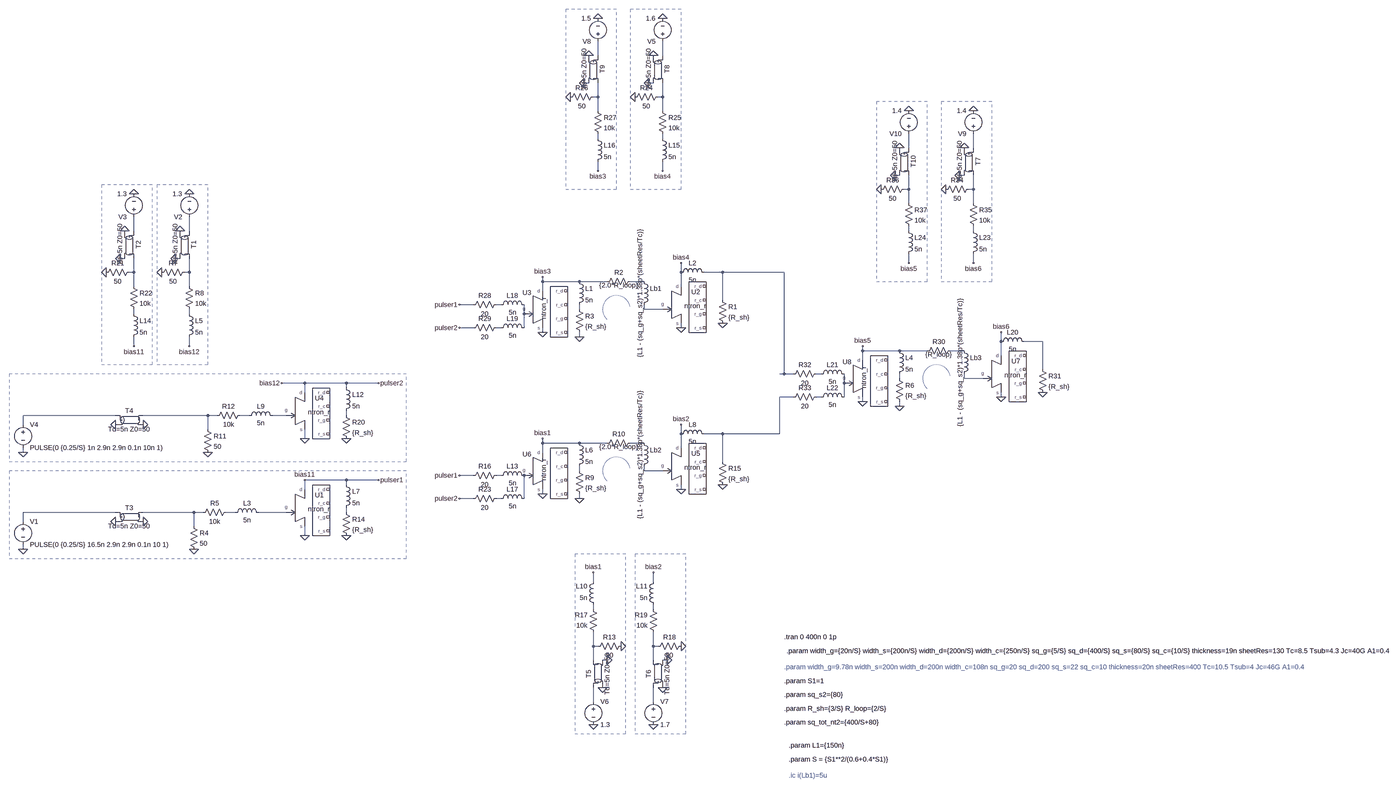
[diagram p0: schematic SNN_2input.asc, whole sheet]
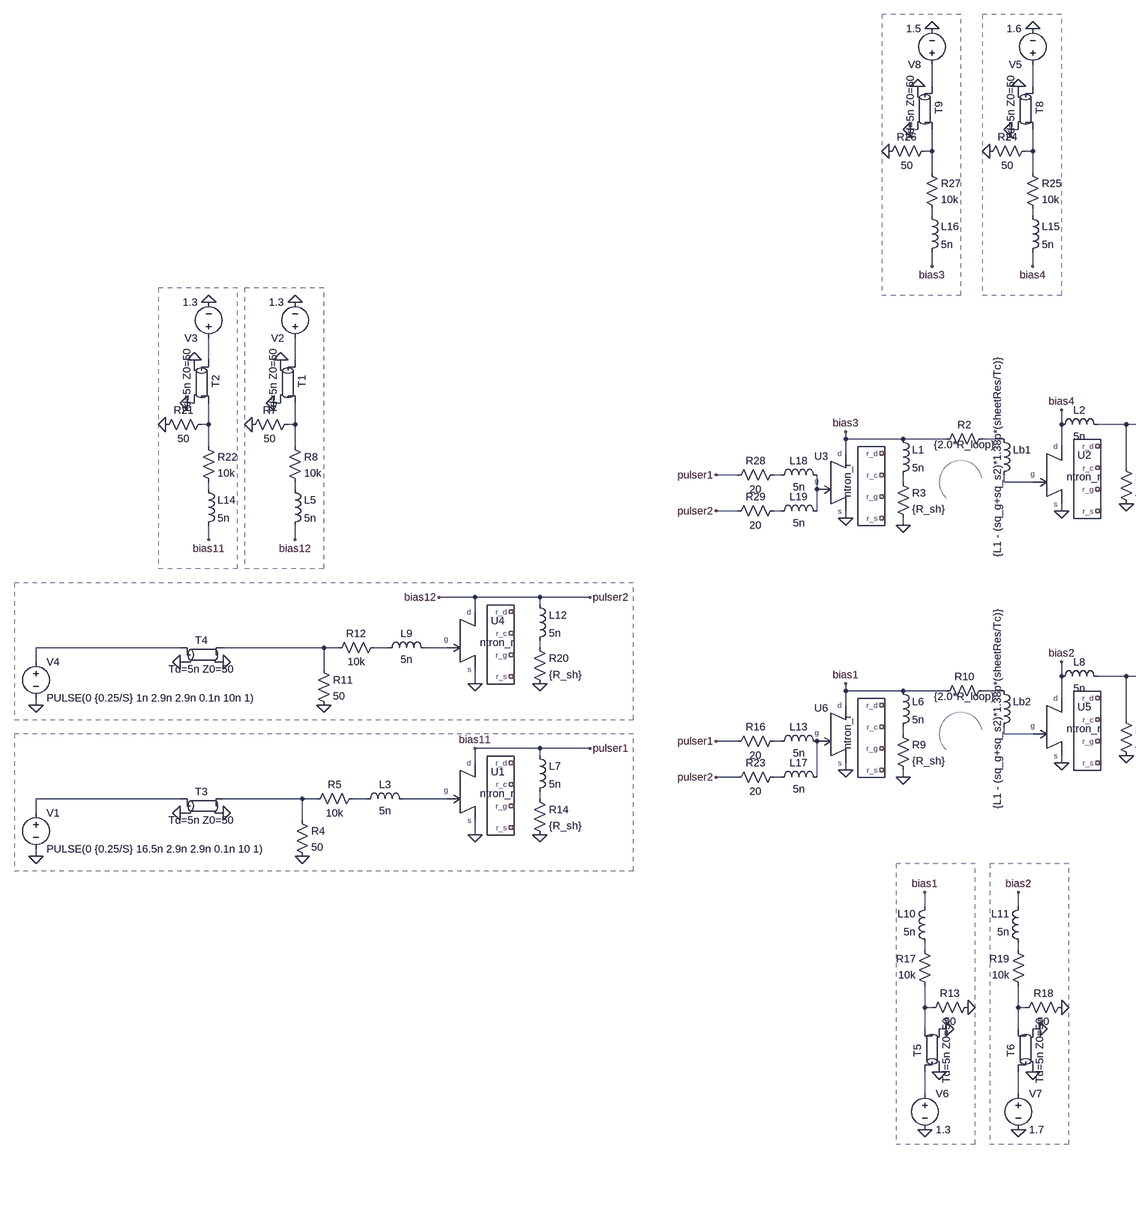
[diagram p1: schematic SNN_2input.asc, part, row 1 of 1, column 1 of 2]
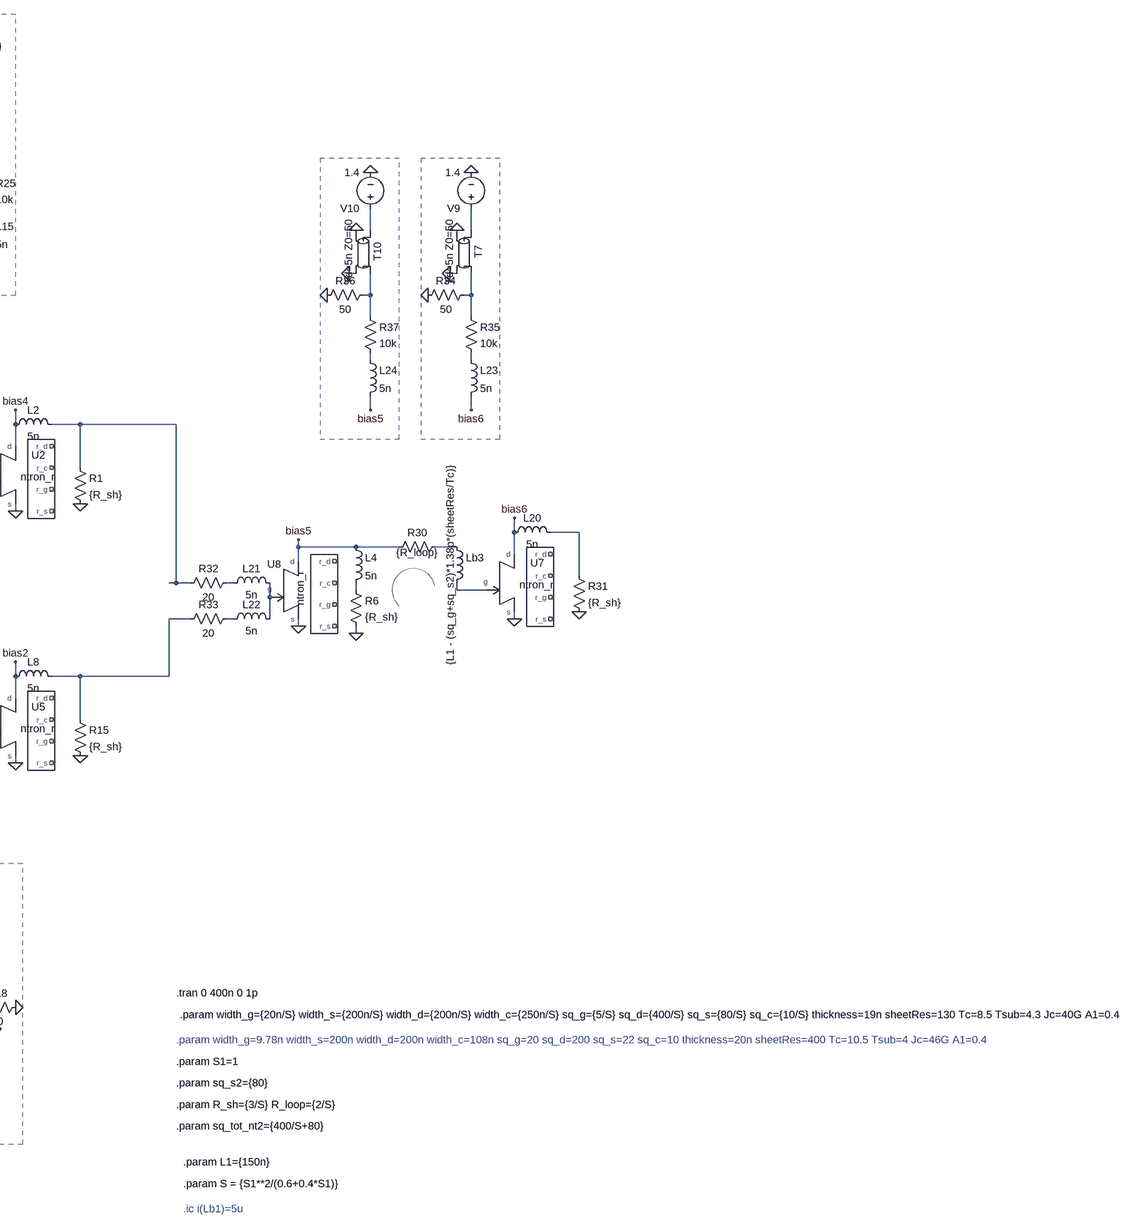
[diagram p2: schematic SNN_2input.asc, part, row 1 of 1, column 2 of 2]
SNN_2input.asc, the LTspice schematic file:
Version 4
SHEET 1 3684 2036
WIRE -992 -1296 -992 -1344
WIRE -768 -1296 -768 -1344
WIRE -1024 -1200 -1040 -1200
WIRE -800 -1200 -816 -1200
WIRE -992 -1152 -992 -1200
WIRE -992 -1152 -1008 -1152
WIRE -768 -1152 -768 -1200
WIRE -768 -1152 -784 -1152
WIRE -992 -1104 -992 -1152
WIRE -768 -1104 -768 -1152
WIRE -992 -1008 -992 -1024
WIRE -768 -1008 -768 -1024
WIRE 240 -976 240 -1024
WIRE 464 -976 464 -1024
WIRE -992 -896 -992 -928
WIRE -768 -896 -768 -928
WIRE 208 -880 192 -880
WIRE 432 -880 416 -880
WIRE 240 -832 240 -880
WIRE 240 -832 224 -832
WIRE 464 -832 464 -880
WIRE 464 -832 448 -832
WIRE 240 -784 240 -832
WIRE 464 -784 464 -832
WIRE -2800 -688 -2800 -736
WIRE -2608 -688 -2608 -736
WIRE 240 -688 240 -704
WIRE 464 -688 464 -704
WIRE -2832 -592 -2848 -592
WIRE -2640 -592 -2656 -592
WIRE 240 -576 240 -608
WIRE 464 -576 464 -608
WIRE -2800 -544 -2800 -592
WIRE -2800 -544 -2816 -544
WIRE -2608 -544 -2608 -592
WIRE -2608 -544 -2624 -544
WIRE -704 -544 -704 -576
WIRE -560 -544 -624 -544
WIRE -192 -544 -560 -544
WIRE -1184 -512 -1184 -528
WIRE -1056 -512 -1184 -512
WIRE -960 -512 -1056 -512
WIRE -832 -512 -880 -512
WIRE -2800 -496 -2800 -544
WIRE -2608 -496 -2608 -544
WIRE -704 -496 -704 -544
WIRE -1184 -480 -1184 -512
WIRE -560 -448 -560 -544
WIRE -1424 -432 -1472 -432
WIRE -1328 -432 -1344 -432
WIRE -1056 -416 -1056 -432
WIRE -832 -416 -832 -432
WIRE -768 -416 -832 -416
WIRE -2800 -400 -2800 -416
WIRE -2608 -400 -2608 -416
WIRE -1248 -400 -1248 -432
WIRE -1424 -352 -1472 -352
WIRE -1328 -352 -1344 -352
WIRE -1248 -352 -1248 -400
WIRE -704 -352 -704 -368
WIRE -1184 -336 -1184 -352
WIRE -1056 -320 -1056 -336
WIRE 560 -304 560 -336
WIRE 704 -304 640 -304
WIRE -2800 -288 -2800 -320
WIRE -2608 -288 -2608 -320
WIRE 80 -272 80 -288
WIRE 208 -272 80 -272
WIRE 304 -272 208 -272
WIRE 432 -272 384 -272
WIRE 560 -256 560 -304
WIRE 80 -240 80 -272
WIRE 704 -208 704 -304
WIRE -192 -192 -192 -544
WIRE -192 -192 -208 -192
WIRE -160 -192 -192 -192
WIRE -64 -192 -80 -192
WIRE 208 -176 208 -192
WIRE 432 -176 432 -192
WIRE 496 -176 432 -176
WIRE -2208 -160 -2288 -160
WIRE -2064 -160 -2208 -160
WIRE -1952 -160 -2064 -160
WIRE 16 -160 16 -192
WIRE -2064 -144 -2064 -160
WIRE -2208 -128 -2208 -160
WIRE -160 -112 -208 -112
WIRE -64 -112 -80 -112
WIRE 16 -112 16 -160
WIRE 560 -112 560 -128
WIRE 80 -96 80 -112
WIRE 208 -80 208 -96
WIRE -2864 -48 -3184 -48
WIRE -2544 -48 -2768 -48
WIRE -2512 -48 -2544 -48
WIRE -2400 -48 -2432 -48
WIRE -2272 -48 -2320 -48
WIRE -2064 -48 -2064 -64
WIRE -3184 -16 -3184 -48
WIRE -2544 0 -2544 -48
WIRE -704 16 -704 -16
WIRE -560 16 -624 16
WIRE -208 16 -208 -112
WIRE -208 16 -560 16
WIRE -2208 32 -2208 0
WIRE -1184 48 -1184 32
WIRE -1056 48 -1184 48
WIRE -960 48 -1056 48
WIRE -832 48 -880 48
WIRE -704 64 -704 16
WIRE -3184 80 -3184 64
WIRE -1184 80 -1184 48
WIRE -560 112 -560 16
WIRE -1056 144 -1056 128
WIRE -832 144 -832 128
WIRE -768 144 -832 144
WIRE -1424 160 -1472 160
WIRE -1328 160 -1344 160
WIRE -2064 176 -2208 176
WIRE -1952 176 -2064 176
WIRE -2064 192 -2064 176
WIRE -2208 208 -2208 176
WIRE -704 208 -704 192
WIRE -1184 224 -1184 208
WIRE -1424 240 -1472 240
WIRE -1328 240 -1344 240
WIRE -1248 240 -1248 160
WIRE -1056 240 -1056 224
WIRE -2864 288 -3184 288
WIRE -2592 288 -2768 288
WIRE -2560 288 -2592 288
WIRE -2448 288 -2480 288
WIRE -2272 288 -2368 288
WIRE -2064 288 -2064 272
WIRE -3184 320 -3184 288
WIRE -2592 336 -2592 288
WIRE -2208 368 -2208 336
WIRE -3184 416 -3184 400
WIRE -1008 528 -1008 496
WIRE -800 528 -800 496
WIRE -1008 624 -1008 608
WIRE -800 624 -800 608
WIRE -1008 752 -1008 704
WIRE -992 752 -1008 752
WIRE -800 752 -800 704
WIRE -784 752 -800 752
WIRE -1008 800 -1008 752
WIRE -960 800 -976 800
WIRE -800 800 -800 752
WIRE -752 800 -768 800
WIRE -1008 944 -1008 896
WIRE -800 944 -800 896
FLAG -704 -352 0
FLAG -1056 -320 0
FLAG -2592 416 0
FLAG -3184 416 0
FLAG -2768 320 0
FLAG -2864 320 0
FLAG -2208 368 0
FLAG -2064 368 0
FLAG -2544 80 0
FLAG -3184 80 0
FLAG -2768 -16 0
FLAG -2864 -16 0
FLAG -1184 -336 0
FLAG -912 752 0
FLAG -976 896 0
FLAG -960 800 0
FLAG -1008 1024 0
FLAG -1008 496 bias1
FLAG -704 752 0
FLAG -768 896 0
FLAG -752 800 0
FLAG -800 1024 0
FLAG -800 496 bias2
FLAG -2208 32 0
FLAG -2064 32 0
FLAG -1952 176 pulser1
FLAG -1952 -160 pulser2
FLAG -2288 -160 bias12
FLAG -864 -1152 0
FLAG -800 -1296 0
FLAG -816 -1200 0
FLAG -768 -1424 0
FLAG -768 -896 bias4
FLAG -1088 -1152 0
FLAG -1024 -1296 0
FLAG -1040 -1200 0
FLAG -992 -1424 0
FLAG -992 -896 bias3
FLAG -1184 -528 bias3
FLAG -704 -576 bias4
FLAG -560 -368 0
FLAG -2704 -544 0
FLAG -2640 -688 0
FLAG -2656 -592 0
FLAG -2608 -816 0
FLAG -2608 -288 bias12
FLAG -704 208 0
FLAG -1056 240 0
FLAG -1184 224 0
FLAG -1184 32 bias1
FLAG -704 -16 bias2
FLAG -560 192 0
FLAG -2896 -544 0
FLAG -2832 -688 0
FLAG -2848 -592 0
FLAG -2800 -816 0
FLAG -2800 -288 bias11
FLAG -2208 176 bias11
FLAG -1472 160 pulser1
FLAG -1472 240 pulser2
FLAG -1472 -432 pulser1
FLAG -1472 -352 pulser2
FLAG 560 -112 0
FLAG 208 -80 0
FLAG 80 -96 0
FLAG 80 -288 bias5
FLAG 560 -336 bias6
FLAG 704 -128 0
FLAG 368 -832 0
FLAG 432 -976 0
FLAG 416 -880 0
FLAG 464 -1104 0
FLAG 464 -576 bias6
FLAG 144 -832 0
FLAG 208 -976 0
FLAG 192 -880 0
FLAG 240 -1104 0
FLAG 240 -576 bias5
SYMBOL ind -848 -528 R0
WINDOW 3 2 -165 VRight 2
SYMATTR Value {L1 - (sq_g+sq_s2)*1.38p*(sheetRes/Tc)}
SYMATTR InstName Lb1
SYMBOL ntron_r -704 -432 R0
WINDOW 39 2 131 Invisible 2
WINDOW 3 50 -11 Top 2
WINDOW 0 51 -28 Bottom 2
SYMATTR SpiceLine width_g={width_g} width_s={width_s} width_d={width_d} width_c={width_c} sq_g={sq_g} sq_d={sq_tot_nt2-sq_s2} sq_s={sq_s2} sq_c={sq_c} thickness={thickness} sheetRes={sheetRes} Tc={Tc} Tsub={Tsub} Jc={Jc} A1={A1}
SYMATTR InstName U2
SYMBOL res -1072 -432 R0
SYMATTR InstName R3
SYMATTR Value {R_sh}
SYMBOL ind -1072 -528 R0
SYMATTR InstName L1
SYMATTR Value 5n
SYMBOL res -2608 320 R0
SYMATTR InstName R4
SYMATTR Value 50
SYMBOL res -2576 304 R270
WINDOW 0 32 56 VTop 2
WINDOW 3 0 56 VBottom 2
SYMATTR InstName R5
SYMATTR Value 10k
SYMBOL ind -2464 304 R270
WINDOW 0 32 56 VTop 2
WINDOW 3 5 56 VBottom 2
SYMATTR InstName L3
SYMATTR Value 5n
SYMBOL voltage -3184 304 R0
WINDOW 123 0 0 Left 2
WINDOW 39 0 0 Left 2
SYMATTR InstName V1
SYMATTR Value PULSE(0 {0.25/S} 16.5n 2.9n 2.9n 0.1n 10 1)
SYMBOL tline -2816 304 R0
SYMATTR InstName T3
SYMATTR Value Td=5n Z0=50
SYMBOL res -976 -496 R270
WINDOW 0 32 56 VTop 2
WINDOW 3 19 56 VBottom 2
SYMATTR InstName R2
SYMATTR Value {2.0*R_loop}
SYMBOL ntron_r -1184 -416 R0
WINDOW 39 2 131 Invisible 2
WINDOW 3 20 -4 VBottom 2
WINDOW 0 -54 -42 Bottom 2
SYMATTR SpiceLine width_g={width_g} width_s={width_s} width_d={width_d} width_c={width_c} sq_g=10 sq_d={sq_d} sq_s={sq_s} sq_c={sq_c} thickness={thickness} sheetRes={sheetRes} Tc={Tc} Tsub={Tsub} Jc={Jc} A1={A1}
SYMATTR InstName U3
SYMBOL res -2080 272 R0
SYMATTR InstName R14
SYMATTR Value {R_sh}
SYMBOL ind -2080 176 R0
SYMATTR InstName L7
SYMATTR Value 5n
SYMBOL ntron_r -2208 272 R0
WINDOW 39 2 131 Invisible 2
WINDOW 3 50 -11 Top 2
WINDOW 0 51 -28 Bottom 2
SYMATTR SpiceLine width_g={width_g} width_s={width_s} width_d={width_d} width_c={width_c} sq_g=10 sq_d={sq_d} sq_s={sq_s} sq_c={sq_c} thickness={thickness} sheetRes={sheetRes} Tc={Tc} Tsub={Tsub} Jc={Jc} A1={A1}
SYMATTR InstName U1
SYMBOL res -2560 -16 R0
SYMATTR InstName R11
SYMATTR Value 50
SYMBOL res -2528 -32 R270
WINDOW 0 32 56 VTop 2
WINDOW 3 0 56 VBottom 2
SYMATTR InstName R12
SYMATTR Value 10k
SYMBOL ind -2416 -32 R270
WINDOW 0 32 56 VTop 2
WINDOW 3 5 56 VBottom 2
SYMATTR InstName L9
SYMATTR Value 5n
SYMBOL voltage -3184 -32 R0
WINDOW 123 0 0 Left 2
WINDOW 39 0 0 Left 2
SYMATTR InstName V4
SYMATTR Value PULSE(0 {0.25/S} 1n 2.9n 2.9n 0.1n 10n 1)
SYMBOL tline -2816 -32 R0
SYMATTR InstName T4
SYMATTR Value Td=5n Z0=50
SYMBOL tline -992 848 R270
SYMATTR InstName T5
SYMATTR Value Td=5n Z0=50
SYMBOL res -1008 768 R270
WINDOW 0 32 56 VTop 2
WINDOW 3 0 56 VBottom 2
SYMATTR InstName R13
SYMATTR Value 50
SYMBOL res -992 720 R180
WINDOW 0 36 76 Left 2
WINDOW 3 36 40 Left 2
SYMATTR InstName R17
SYMATTR Value 10k
SYMBOL ind -992 624 R180
WINDOW 0 36 80 Left 2
WINDOW 3 36 40 Left 2
SYMATTR InstName L10
SYMATTR Value 5n
SYMBOL voltage -1008 928 R0
WINDOW 123 0 0 Left 2
WINDOW 39 0 0 Left 2
SYMATTR InstName V6
SYMATTR Value 1.3
SYMBOL tline -784 848 R270
SYMATTR InstName T6
SYMATTR Value Td=5n Z0=50
SYMBOL res -800 768 R270
WINDOW 0 32 56 VTop 2
WINDOW 3 0 56 VBottom 2
SYMATTR InstName R18
SYMATTR Value 50
SYMBOL res -784 720 R180
WINDOW 0 36 76 Left 2
WINDOW 3 36 40 Left 2
SYMATTR InstName R19
SYMATTR Value 10k
SYMBOL ind -784 624 R180
WINDOW 0 36 80 Left 2
WINDOW 3 36 40 Left 2
SYMATTR InstName L11
SYMATTR Value 5n
SYMBOL voltage -800 928 R0
WINDOW 123 0 0 Left 2
WINDOW 39 0 0 Left 2
SYMATTR InstName V7
SYMATTR Value 1.7
SYMBOL res -2080 -64 R0
SYMATTR InstName R20
SYMATTR Value {R_sh}
SYMBOL ind -2080 -160 R0
SYMATTR InstName L12
SYMATTR Value 5n
SYMBOL ntron_r -2208 -64 R0
WINDOW 39 2 131 Invisible 2
WINDOW 3 50 -11 Top 2
WINDOW 0 51 -28 Bottom 2
SYMATTR SpiceLine width_g={width_g} width_s={width_s} width_d={width_d} width_c={width_c} sq_g=10 sq_d={sq_d} sq_s={sq_s} sq_c={sq_c} thickness={thickness} sheetRes={sheetRes} Tc={Tc} Tsub={Tsub} Jc={Jc} A1={A1}
SYMATTR InstName U4
SYMBOL tline -784 -1248 R90
SYMATTR InstName T8
SYMATTR Value Td=5n Z0=50
SYMBOL res -768 -1168 R90
WINDOW 0 0 56 VBottom 2
WINDOW 3 32 56 VTop 2
SYMATTR InstName R24
SYMATTR Value 50
SYMBOL res -784 -1120 R0
SYMATTR InstName R25
SYMATTR Value 10k
SYMBOL ind -784 -1024 R0
SYMATTR InstName L15
SYMATTR Value 5n
SYMBOL voltage -768 -1328 R180
WINDOW 123 0 0 Left 2
WINDOW 39 0 0 Left 2
SYMATTR InstName V5
SYMATTR Value 1.6
SYMBOL tline -1008 -1248 R90
SYMATTR InstName T9
SYMATTR Value Td=5n Z0=50
SYMBOL res -992 -1168 R90
WINDOW 0 0 56 VBottom 2
WINDOW 3 32 56 VTop 2
SYMATTR InstName R26
SYMATTR Value 50
SYMBOL res -1008 -1120 R0
SYMATTR InstName R27
SYMATTR Value 10k
SYMBOL ind -1008 -1024 R0
SYMATTR InstName L16
SYMATTR Value 5n
SYMBOL voltage -992 -1328 R180
WINDOW 123 0 0 Left 2
WINDOW 39 0 0 Left 2
SYMATTR InstName V8
SYMATTR Value 1.5
SYMBOL ind -720 -528 R270
WINDOW 0 32 56 VTop 2
WINDOW 3 5 56 VBottom 2
SYMATTR InstName L2
SYMATTR Value 5n
SYMBOL res -576 -464 R0
SYMATTR InstName R1
SYMATTR Value {R_sh}
SYMBOL tline -2624 -640 R90
SYMATTR InstName T1
SYMATTR Value Td=5n Z0=50
SYMBOL res -2608 -560 R90
WINDOW 0 0 56 VBottom 2
WINDOW 3 32 56 VTop 2
SYMATTR InstName R7
SYMATTR Value 50
SYMBOL res -2624 -512 R0
SYMATTR InstName R8
SYMATTR Value 10k
SYMBOL ind -2624 -416 R0
SYMATTR InstName L5
SYMATTR Value 5n
SYMBOL voltage -2608 -720 R180
WINDOW 123 0 0 Left 2
WINDOW 39 0 0 Left 2
SYMATTR InstName V2
SYMATTR Value 1.3
SYMBOL ind -848 32 R0
WINDOW 3 2 -165 VRight 2
SYMATTR Value {L1 - (sq_g+sq_s2)*1.38p*(sheetRes/Tc)}
SYMATTR InstName Lb2
SYMBOL ntron_r -704 128 R0
WINDOW 39 2 131 Invisible 2
WINDOW 3 50 -11 Top 2
WINDOW 0 51 -28 Bottom 2
SYMATTR SpiceLine width_g={width_g} width_s={width_s} width_d={width_d} width_c={width_c} sq_g={sq_g} sq_d={sq_tot_nt2-sq_s2} sq_s={sq_s2} sq_c={sq_c} thickness={thickness} sheetRes={sheetRes} Tc={Tc} Tsub={Tsub} Jc={Jc} A1={A1}
SYMATTR InstName U5
SYMBOL res -1072 128 R0
SYMATTR InstName R9
SYMATTR Value {R_sh}
SYMBOL ind -1072 32 R0
SYMATTR InstName L6
SYMATTR Value 5n
SYMBOL res -976 64 R270
WINDOW 0 32 56 VTop 2
WINDOW 3 19 56 VBottom 2
SYMATTR InstName R10
SYMATTR Value {2.0*R_loop}
SYMBOL ntron_r -1184 144 R0
WINDOW 39 2 131 Invisible 2
WINDOW 3 20 -4 VBottom 2
WINDOW 0 -54 -42 Bottom 2
SYMATTR SpiceLine width_g={width_g} width_s={width_s} width_d={width_d} width_c={width_c} sq_g=10 sq_d={sq_d} sq_s={sq_s} sq_c={sq_c} thickness={thickness} sheetRes={sheetRes} Tc={Tc} Tsub={Tsub} Jc={Jc} A1={A1}
SYMATTR InstName U6
SYMBOL ind -720 32 R270
WINDOW 0 32 56 VTop 2
WINDOW 3 5 56 VBottom 2
SYMATTR InstName L8
SYMATTR Value 5n
SYMBOL res -576 96 R0
SYMATTR InstName R15
SYMATTR Value {R_sh}
SYMBOL ind -1344 176 R270
WINDOW 0 32 56 VTop 2
WINDOW 3 5 56 VBottom 2
SYMATTR InstName L13
SYMATTR Value 5n
SYMBOL res -1328 144 R90
WINDOW 0 0 56 VBottom 2
WINDOW 3 32 56 VTop 2
SYMATTR InstName R16
SYMATTR Value 20
SYMBOL tline -2816 -640 R90
SYMATTR InstName T2
SYMATTR Value Td=5n Z0=50
SYMBOL res -2800 -560 R90
WINDOW 0 0 56 VBottom 2
WINDOW 3 32 56 VTop 2
SYMATTR InstName R21
SYMATTR Value 50
SYMBOL res -2816 -512 R0
SYMATTR InstName R22
SYMATTR Value 10k
SYMBOL ind -2816 -416 R0
SYMATTR InstName L14
SYMATTR Value 5n
SYMBOL voltage -2800 -720 R180
WINDOW 123 0 0 Left 2
WINDOW 39 0 0 Left 2
SYMATTR InstName V3
SYMATTR Value 1.3
SYMBOL ind -1344 256 R270
WINDOW 0 32 56 VTop 2
WINDOW 3 5 56 VBottom 2
SYMATTR InstName L17
SYMATTR Value 5n
SYMBOL res -1328 224 R90
WINDOW 0 0 56 VBottom 2
WINDOW 3 32 56 VTop 2
SYMATTR InstName R23
SYMATTR Value 20
SYMBOL ind -1344 -416 R270
WINDOW 0 32 56 VTop 2
WINDOW 3 5 56 VBottom 2
SYMATTR InstName L18
SYMATTR Value 5n
SYMBOL res -1328 -448 R90
WINDOW 0 0 56 VBottom 2
WINDOW 3 32 56 VTop 2
SYMATTR InstName R28
SYMATTR Value 20
SYMBOL ind -1344 -336 R270
WINDOW 0 32 56 VTop 2
WINDOW 3 5 56 VBottom 2
SYMATTR InstName L19
SYMATTR Value 5n
SYMBOL res -1328 -368 R90
WINDOW 0 0 56 VBottom 2
WINDOW 3 32 56 VTop 2
SYMATTR InstName R29
SYMATTR Value 20
SYMBOL ind 416 -288 R0
WINDOW 3 2 -165 VRight 2
SYMATTR Value {L1 - (sq_g+sq_s2)*1.38p*(sheetRes/Tc)}
SYMATTR InstName Lb3
SYMBOL ntron_r 560 -192 R0
WINDOW 39 2 131 Invisible 2
WINDOW 3 50 -11 Top 2
WINDOW 0 51 -28 Bottom 2
SYMATTR SpiceLine width_g={width_g} width_s={width_s} width_d={width_d} width_c={width_c} sq_g={sq_g} sq_d={sq_tot_nt2-sq_s2} sq_s={sq_s2} sq_c={sq_c} thickness={thickness} sheetRes={sheetRes} Tc={Tc} Tsub={Tsub} Jc={Jc} A1={A1}
SYMATTR InstName U7
SYMBOL res 192 -192 R0
SYMATTR InstName R6
SYMATTR Value {R_sh}
SYMBOL ind 192 -288 R0
SYMATTR InstName L4
SYMATTR Value 5n
SYMBOL res 288 -256 R270
WINDOW 0 32 56 VTop 2
WINDOW 3 19 56 VBottom 2
SYMATTR InstName R30
SYMATTR Value {R_loop}
SYMBOL ntron_r 80 -176 R0
WINDOW 39 2 131 Invisible 2
WINDOW 3 20 -4 VBottom 2
WINDOW 0 -54 -42 Bottom 2
SYMATTR SpiceLine width_g={width_g} width_s={width_s} width_d={width_d} width_c={width_c} sq_g=10 sq_d={sq_d} sq_s={sq_s} sq_c={sq_c} thickness={thickness} sheetRes={sheetRes} Tc={Tc} Tsub={Tsub} Jc={Jc} A1={A1}
SYMATTR InstName U8
SYMBOL ind 544 -288 R270
WINDOW 0 32 56 VTop 2
WINDOW 3 5 56 VBottom 2
SYMATTR InstName L20
SYMATTR Value 5n
SYMBOL res 688 -224 R0
SYMATTR InstName R31
SYMATTR Value {R_sh}
SYMBOL ind -80 -176 R270
WINDOW 0 32 56 VTop 2
WINDOW 3 5 56 VBottom 2
SYMATTR InstName L21
SYMATTR Value 5n
SYMBOL res -64 -208 R90
WINDOW 0 0 56 VBottom 2
WINDOW 3 32 56 VTop 2
SYMATTR InstName R32
SYMATTR Value 20
SYMBOL ind -80 -96 R270
WINDOW 0 32 56 VTop 2
WINDOW 3 5 56 VBottom 2
SYMATTR InstName L22
SYMATTR Value 5n
SYMBOL res -64 -128 R90
WINDOW 0 0 56 VBottom 2
WINDOW 3 32 56 VTop 2
SYMATTR InstName R33
SYMATTR Value 20
SYMBOL tline 448 -928 R90
SYMATTR InstName T7
SYMATTR Value Td=5n Z0=50
SYMBOL res 464 -848 R90
WINDOW 0 0 56 VBottom 2
WINDOW 3 32 56 VTop 2
SYMATTR InstName R34
SYMATTR Value 50
SYMBOL res 448 -800 R0
SYMATTR InstName R35
SYMATTR Value 10k
SYMBOL ind 448 -704 R0
SYMATTR InstName L23
SYMATTR Value 5n
SYMBOL voltage 464 -1008 R180
WINDOW 123 0 0 Left 2
WINDOW 39 0 0 Left 2
SYMATTR InstName V9
SYMATTR Value 1.4
SYMBOL tline 224 -928 R90
SYMATTR InstName T10
SYMATTR Value Td=5n Z0=50
SYMBOL res 240 -848 R90
WINDOW 0 0 56 VBottom 2
WINDOW 3 32 56 VTop 2
SYMATTR InstName R36
SYMATTR Value 50
SYMBOL res 224 -800 R0
SYMATTR InstName R37
SYMATTR Value 10k
SYMBOL ind 224 -704 R0
SYMATTR InstName L24
SYMATTR Value 5n
SYMBOL voltage 240 -1008 R180
WINDOW 123 0 0 Left 2
WINDOW 39 0 0 Left 2
SYMATTR InstName V10
SYMATTR Value 1.4
TEXT -192 720 Left 2 !.tran 0 400n 0 1p
TEXT -176 1200 Left 2 ;.ic i(Lb1)=5u
TEXT -184 768 Left 2 !.param width_g={20n/S} width_s={200n/S} width_d={200n/S} width_c={250n/S} sq_g={5/S} sq_d={400/S} sq_s={80/S} sq_c={10/S} thickness=19n sheetRes=130 Tc=8.5 Tsub=4.3 Jc=40G A1=0.4
TEXT -192 968 Left 2 !.param R_sh={3/S} R_loop={2/S}
TEXT -192 824 Left 2 ;.param width_g=9.78n width_s=200n width_d=200n width_c=108n sq_g=20 sq_d=200 sq_s=22 sq_c=10 thickness=20n sheetRes=400 Tc=10.5 Tsub=4 Jc=46G A1=0.4
TEXT -192 920 Left 2 !.param sq_s2={80}
TEXT -192 1016 Left 2 !.param sq_tot_nt2={400/S+80}
TEXT -176 1096 Left 2 !.param L1={150n}
TEXT -192 872 Left 2 !.param S1=1
TEXT -176 1144 Left 2 !.param S = {S1**2/(0.6+0.4*S1)}
RECTANGLE Normal -896 432 -1072 1056 2
RECTANGLE Normal -688 432 -864 1056 2
RECTANGLE Normal -3232 112 -1856 -192 2
RECTANGLE Normal -3232 448 -1856 144 2
RECTANGLE Normal -880 -832 -704 -1456 2
RECTANGLE Normal -1104 -832 -928 -1456 2
RECTANGLE Normal -2720 -224 -2544 -848 2
RECTANGLE Normal -2912 -224 -2736 -848 2
RECTANGLE Normal 352 -512 528 -1136 2
RECTANGLE Normal 128 -512 304 -1136 2
ARC Normal -976 -368 -880 -464 -859 -429 -963 -379 2
ARC Normal -976 192 -880 96 -859 131 -963 181 2
ARC Normal 288 -128 384 -224 405 -189 301 -139 2

The netlist it stands for:
* SNN_2input.asc
Lb1 N018 N021 {L1 - (sq_g+sq_s2)*1.38p*(sheetRes/Tc)}
XU2 N021 bias4 0 NC_01 NC_02 NC_03 NC_04 ntron_r ntron_r width_g={width_g} width_s={width_s} width_d={width_d} width_c={width_c} sq_g={sq_g} sq_d={sq_tot_nt2-sq_s2} sq_s={sq_s2} sq_c={sq_c} thickness={thickness} sheetRes={sheetRes} Tc={Tc} Tsub={Tsub} Jc={Jc} A1={A1}  ; pins g d s r_g r_d r_c r_s
R3 N020 0 {R_sh}
L1 bias3 N020 5n
R4 N046 0 50
R5 N046 N047 10k
L3 N047 N048 5n
V1 N045 0 PULSE(0 {0.25/S} 16.5n 2.9n 2.9n 0.1n 10 1)
T3 N045 0 N046 0 Td=5n Z0=50
R2 bias3 N018 {2.0*R_loop}
XU3 N024 bias3 0 NC_05 NC_06 NC_07 NC_08 ntron_r ntron_r width_g={width_g} width_s={width_s} width_d={width_d} width_c={width_c} sq_g=10 sq_d={sq_d} sq_s={sq_s} sq_c={sq_c} thickness={thickness} sheetRes={sheetRes} Tc={Tc} Tsub={Tsub} Jc={Jc} A1={A1}  ; pins g d s r_g r_d r_c r_s
R14 N049 0 {R_sh}
L7 bias11 N049 5n
XU1 N048 bias11 0 NC_09 NC_10 NC_11 NC_12 ntron_r ntron_r width_g={width_g} width_s={width_s} width_d={width_d} width_c={width_c} sq_g=10 sq_d={sq_d} sq_s={sq_s} sq_c={sq_c} thickness={thickness} sheetRes={sheetRes} Tc={Tc} Tsub={Tsub} Jc={Jc} A1={A1}  ; pins g d s r_g r_d r_c r_s
R11 N035 0 50
R12 N035 N036 10k
L9 N036 N037 5n
V4 N034 0 PULSE(0 {0.25/S} 1n 2.9n 2.9n 0.1n 10n 1)
T4 N034 0 N035 0 Td=5n Z0=50
T5 N054 0 N052 0 Td=5n Z0=50
R13 N052 0 50
R17 N052 N050 10k
L10 N050 bias1 5n
V6 N054 0 1.3
T6 N055 0 N053 0 Td=5n Z0=50
R18 N053 0 50
R19 N053 N051 10k
L11 N051 bias2 5n
V7 N055 0 1.7
R20 N038 0 {R_sh}
L12 bias12 N038 5n
XU4 N037 bias12 0 NC_13 NC_14 NC_15 NC_16 ntron_r ntron_r width_g={width_g} width_s={width_s} width_d={width_d} width_c={width_c} sq_g=10 sq_d={sq_d} sq_s={sq_s} sq_c={sq_c} thickness={thickness} sheetRes={sheetRes} Tc={Tc} Tsub={Tsub} Jc={Jc} A1={A1}  ; pins g d s r_g r_d r_c r_s
T8 N002 0 N004 0 Td=5n Z0=50
R24 N004 0 50
R25 N004 N006 10k
L15 N006 bias4 5n
V5 N002 0 1.6
T9 N001 0 N003 0 Td=5n Z0=50
R26 N003 0 50
R27 N003 N005 10k
L16 N005 bias3 5n
V8 N001 0 1.5
L2 bias4 N017 5n
R1 N017 0 {R_sh}
T1 N012 0 N016 0 Td=5n Z0=50
R7 N016 0 50
R8 N016 N023 10k
L5 N023 bias12 5n
V2 N012 0 1.3
Lb2 N039 N041 {L1 - (sq_g+sq_s2)*1.38p*(sheetRes/Tc)}
XU5 N041 bias2 0 NC_17 NC_18 NC_19 NC_20 ntron_r ntron_r width_g={width_g} width_s={width_s} width_d={width_d} width_c={width_c} sq_g={sq_g} sq_d={sq_tot_nt2-sq_s2} sq_s={sq_s2} sq_c={sq_c} thickness={thickness} sheetRes={sheetRes} Tc={Tc} Tsub={Tsub} Jc={Jc} A1={A1}  ; pins g d s r_g r_d r_c r_s
R9 N040 0 {R_sh}
L6 bias1 N040 5n
R10 bias1 N039 {2.0*R_loop}
XU6 N044 bias1 0 NC_21 NC_22 NC_23 NC_24 ntron_r ntron_r width_g={width_g} width_s={width_s} width_d={width_d} width_c={width_c} sq_g=10 sq_d={sq_d} sq_s={sq_s} sq_c={sq_c} thickness={thickness} sheetRes={sheetRes} Tc={Tc} Tsub={Tsub} Jc={Jc} A1={A1}  ; pins g d s r_g r_d r_c r_s
L8 bias2 N032 5n
R15 N032 0 {R_sh}
L13 N042 N044 5n
R16 N042 bias11 20
T2 N011 0 N015 0 Td=5n Z0=50
R21 N015 0 50
R22 N015 N022 10k
L14 N022 bias11 5n
V3 N011 0 1.3
L17 N043 N044 5n
R23 N043 bias12 20
L18 N019 N024 5n
R28 N019 bias11 20
L19 N025 N024 5n
R29 N025 bias12 20
Lb3 N027 N030 {L1 - (sq_g+sq_s2)*1.38p*(sheetRes/Tc)}
XU7 N030 bias6 0 NC_25 NC_26 NC_27 NC_28 ntron_r ntron_r width_g={width_g} width_s={width_s} width_d={width_d} width_c={width_c} sq_g={sq_g} sq_d={sq_tot_nt2-sq_s2} sq_s={sq_s2} sq_c={sq_c} thickness={thickness} sheetRes={sheetRes} Tc={Tc} Tsub={Tsub} Jc={Jc} A1={A1}  ; pins g d s r_g r_d r_c r_s
R6 N029 0 {R_sh}
L4 bias5 N029 5n
R30 bias5 N027 {R_loop}
XU8 N031 bias5 0 NC_29 NC_30 NC_31 NC_32 ntron_r ntron_r width_g={width_g} width_s={width_s} width_d={width_d} width_c={width_c} sq_g=10 sq_d={sq_d} sq_s={sq_s} sq_c={sq_c} thickness={thickness} sheetRes={sheetRes} Tc={Tc} Tsub={Tsub} Jc={Jc} A1={A1}  ; pins g d s r_g r_d r_c r_s
L20 bias6 N026 5n
R31 N026 0 {R_sh}
L21 N028 N031 5n
R32 N028 N017 20
L22 N033 N031 5n
R33 N033 N032 20
T7 N008 0 N010 0 Td=5n Z0=50
R34 N010 0 50
R35 N010 N014 10k
L23 N014 bias6 5n
V9 N008 0 1.4
T10 N007 0 N009 0 Td=5n Z0=50
R36 N009 0 50
R37 N009 N013 10k
L24 N013 bias5 5n
V10 N007 0 1.4
.tran 0 400n 0 1p
* .ic i(Lb1)=5u
.param width_g={20n/S} width_s={200n/S} width_d={200n/S} width_c={250n/S} sq_g={5/S} sq_d={400/S} sq_s={80/S} sq_c={10/S} thickness=19n sheetRes=130 Tc=8.5 Tsub=4.3 Jc=40G A1=0.4
.param R_sh={3/S} R_loop={2/S}
* .param width_g=9.78n width_s=200n width_d=200n width_c=108n sq_g=20 sq_d=200 sq_s=22 sq_c=10 thickness=20n sheetRes=400 Tc=10.5 Tsub=4 Jc=46G A1=0.4
.param sq_s2={80}
.param sq_tot_nt2={400/S+80}
.param L1={150n}
.param S1=1
.param S = {S1**2/(0.6+0.4*S1)}
.lib ntron_2.lib
.backanno
.end